# Altium schematic sheet Rover_Science_Card_V1.SchDoc
size A4; SheetNumber: 1; SheetTotal: 1
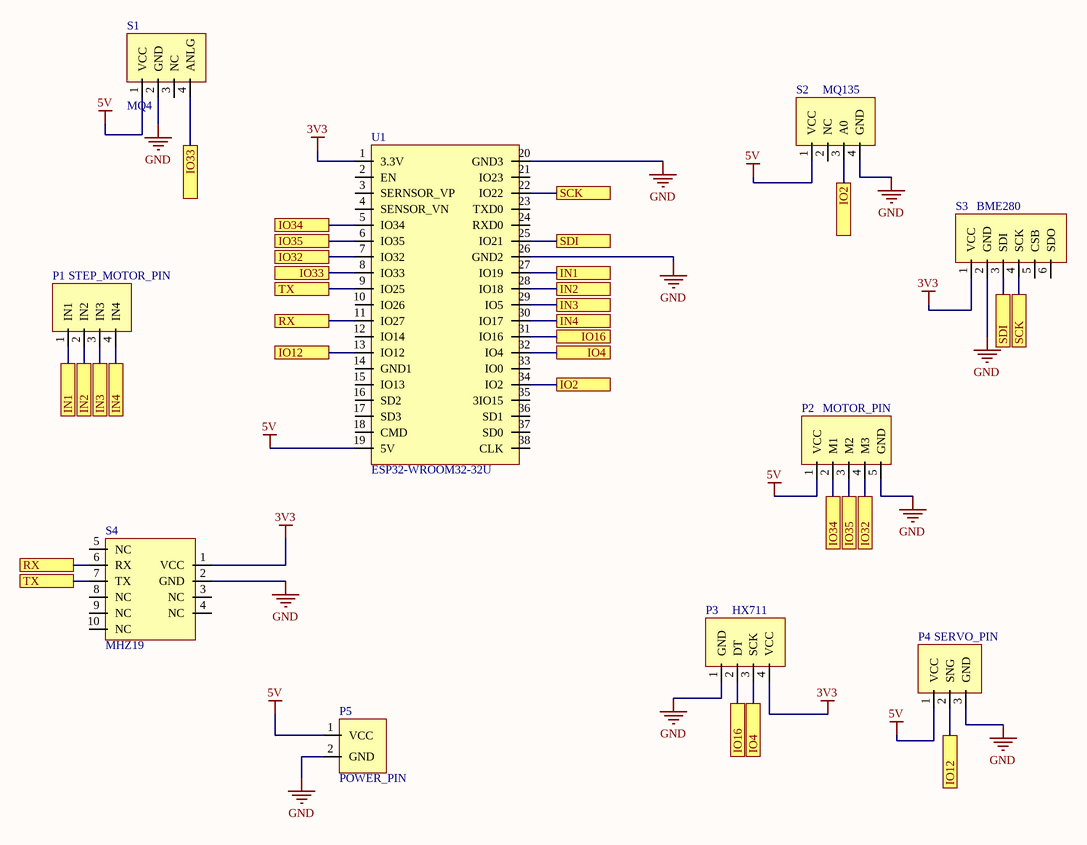
[diagram p0: Rover_Science_Card_V1.SchDoc]

## Parts
P1  STEP_MOTOR_PIN  [HX711]
P2  MOTOR_PIN  [Motor_PIN]
P3  HX711  [HX711]
P4  SERVO_PIN  [Servo PIN]
P5  POWER_PIN  [POWER]
S1  MQ4  [MQ4]
S2  MQ135  [MQ135]
S3  BME280  [BME280]
S4  MHZ19  [MHZ19]
U1  ESP32-WROOM32-32U  [ESP32-WROOM-32U]

## Ports
IN1 (see Rover_Science_Card_V1[1B]), IN1 (see Rover_Science_Card_V1[3B]), IN2 (see Rover_Science_Card_V1[1B]), IN2 (see Rover_Science_Card_V1[3B]), IN3 (see Rover_Science_Card_V1[1B]), IN3 (see Rover_Science_Card_V1[3B]), IN4 (see Rover_Science_Card_V1[1B]), IN4 (see Rover_Science_Card_V1[3B]), IO2 (see Rover_Science_Card_V1[3B]), IO4 (see Rover_Science_Card_V1[3B]), IO4 (see Rover_Science_Card_V1[3D]), IO12 (see Rover_Science_Card_V1[2B]), IO12 (see Rover_Science_Card_V1[4D]), IO16 (see Rover_Science_Card_V1[3B]), IO16 (see Rover_Science_Card_V1[3D]), IO32 (see Rover_Science_Card_V1[2B]), IO32 (see Rover_Science_Card_V1[3C]), IO33 (see Rover_Science_Card_V1[2A]), IO33 (see Rover_Science_Card_V1[2B]), IO34 (see Rover_Science_Card_V1[2B]), IO34 (see Rover_Science_Card_V1[3C]), IO35 (see Rover_Science_Card_V1[2B]), IO35 (see Rover_Science_Card_V1[3C]), RX (see Rover_Science_Card_V1[1C]), RX (see Rover_Science_Card_V1[2B]), SCK (see Rover_Science_Card_V1[3A]), SCK (see Rover_Science_Card_V1[4B]), SDI (see Rover_Science_Card_V1[3B]), SDI (see Rover_Science_Card_V1[4B]), TX (see Rover_Science_Card_V1[1C]), TX (see Rover_Science_Card_V1[2B])

## Nets
3V3: P3.4(VCC) S3.1(VCC) S4.1(VCC) U1.1(3.3V)
5V: P2.1(VCC) P4.1(VCC) P5.1(VCC) S1.1(VCC) S2.1(VCC) U1.19(5V)
GND: P2.5(GND) P3.1(GND) P4.3(GND) P5.2(GND) S1.2(GND) S2.4(GND) S3.2(GND) S4.2(GND) U1.20(GND3) U1.26(GND2)
IN1: P1.1(IN1) U1.27(IO19) ; port IN1
IN2: P1.2(IN2) U1.28(IO18) ; port IN2
IN3: P1.3(IN3) U1.29(IO5) ; port IN3
IN4: P1.4(IN4) U1.30(IO17) ; port IN4
IO2: S2.3(A0) U1.34(IO2) ; port IO2
IO4: P3.3(SCK) U1.32(IO4) ; port IO4
IO12: P4.2(SNG) U1.13(IO12) ; port IO12
IO16: P3.2(DT) U1.31(IO16) ; port IO16
IO32: P2.4(M3) U1.7(IO32) ; port IO32
IO33: S1.4(ANLG) U1.8(IO33) ; port IO33
IO34: P2.2(M1) U1.5(IO34) ; port IO34
IO35: P2.3(M2) U1.6(IO35) ; port IO35
RX: S4.6(RX) U1.11(IO27) ; port RX
SCK: S3.4(SCK) U1.22(IO22) ; port SCK
SDI: S3.3(SDI) U1.25(IO21) ; port SDI
TX: S4.7(TX) U1.9(IO25) ; port TX

Not connected (* = marked no-connect by the designer): S1 3(NC); S2 2(NC); S3 5(CSB) 6(SDO); S4 3(NC) 4(NC) 5(NC) 8(NC) 9(NC) 10(NC); U1 2(EN) 3(SERNSOR_VP) 4(SENSOR_VN) 10(IO26) 12(IO14) 14(GND1) 15(IO13) 16(SD2) 17(SD3) 18(CMD) 21(IO23) 23(TXD0) 24(RXD0) 33(IO0) 35(3IO15) 36(SD1) 37(SD0) 38(CLK)